# Altium schematic sheet FPGA_CONN_OUT.SchDoc
size 420 x 297 mm; SheetNumber: 31; SheetTotal: 34
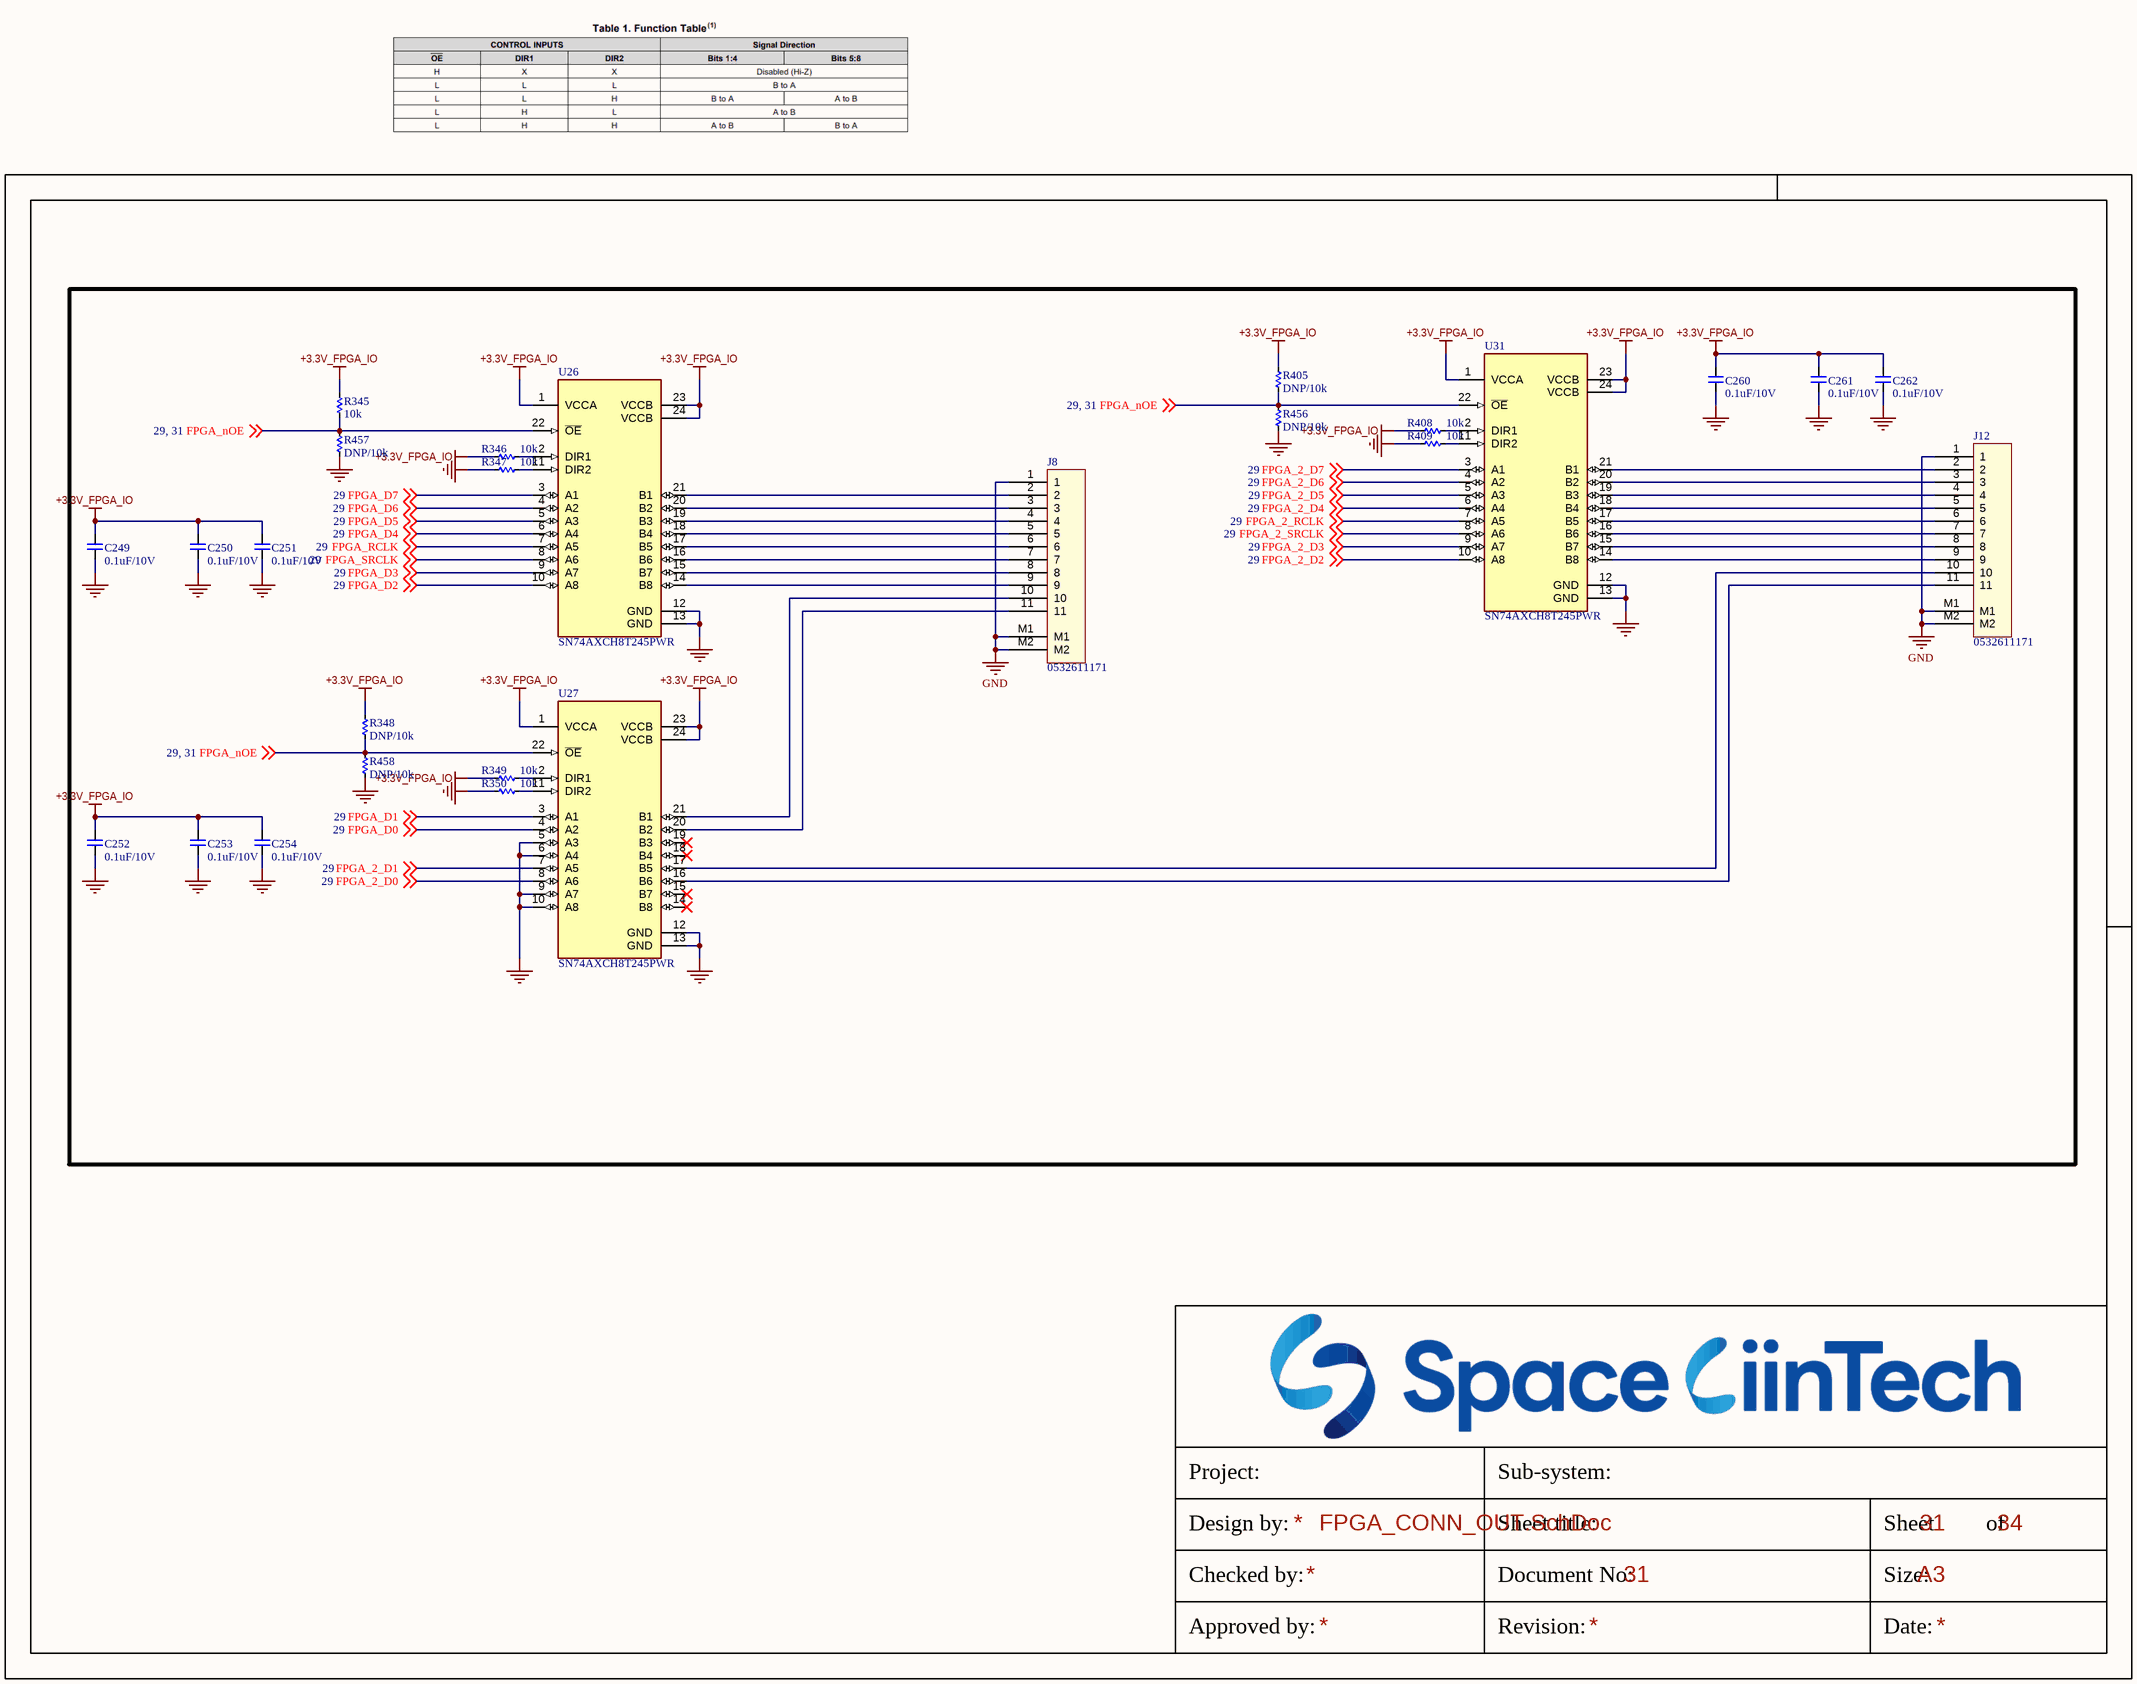
[diagram p0: FPGA_CONN_OUT.SchDoc]

## Parts
C249  0.1uF/10V  [CAP_C_1005X50_L]
C250  0.1uF/10V  [CAP_C_1005X50_L]
C251  0.1uF/10V  [CAP_C_1005X50_L]
C252  0.1uF/10V  [CAP_C_1005X50_L]
C253  0.1uF/10V  [CAP_C_1005X50_L]
C254  0.1uF/10V  [CAP_C_1005X50_L]
C260  0.1uF/10V  [CAP_C_1005X50_L]
C261  0.1uF/10V  [CAP_C_1005X50_L]
C262  0.1uF/10V  [CAP_C_1005X50_L]
J8  0532611171  [MOLEX_0532611171]
J12  0532611171  [MOLEX_0532611171]
R345  10k  [RES_C_1005x30_L]
R346  10k  [RES_C_1005x30_L]
R347  10k  [RES_C_1005x30_L]
R348  DNP/10k  [RES_C_1005x30_L]
R349  10k  [RES_C_1005x30_L]
R350  10k  [RES_C_1005x30_L]
R405  DNP/10k  [RES_C_1005x30_L]
R408  10k  [RES_C_1005x30_L]
R409  10k  [RES_C_1005x30_L]
R456  DNP/10k  [RES_C_1005x30_L]
R457  DNP/10k  [RES_C_1005x30_L]
R458  DNP/10k  [RES_C_1005x30_L]
U26  SN74AXCH8T245PWR  [SOP65P640X120-24N]
U27  SN74AXCH8T245PWR  [SOP65P640X120-24N]
U31  SN74AXCH8T245PWR  [SOP65P640X120-24N]

## Nets
+3.3V_FPGA_IO: C249.2 C250.2 C251.2 C252.2 C253.2 C254.2 C260.2 C261.2 C262.2 R345.1 R346.1 R348.1 R349.1 R405.1 R408.1 U26.1(VCCA) U26.23(VCCB) U26.24(VCCB) U27.1(VCCA) U27.23(VCCB) U27.24(VCCB) U31.1(VCCA) U31.23(VCCB) U31.24(VCCB)
GND: C249.1 C250.1 C251.1 C252.1 C253.1 C254.1 C260.1 C261.1 C262.1 J8.1 J8.M1 J8.M2 J12.1 J12.M1 J12.M2 R347.1 R350.1 R409.1 R456.2 R457.2 R458.2 U26.12(GND) U26.13(GND) U27.5(A3) U27.6(A4) U27.9(A7) U27.10(A8) U27.12(GND) U27.13(GND) U31.12(GND) U31.13(GND)
FPGA_2_D0: U27.8(A6) ; off-sheet FPGA_2_D0
FPGA_2_D1: U27.7(A5) ; off-sheet FPGA_2_D1
FPGA_2_D2: U31.10(A8) ; off-sheet FPGA_2_D2
FPGA_2_D3: U31.9(A7) ; off-sheet FPGA_2_D3
FPGA_2_D4: U31.6(A4) ; off-sheet FPGA_2_D4
FPGA_2_D5: U31.5(A3) ; off-sheet FPGA_2_D5
FPGA_2_D6: U31.4(A2) ; off-sheet FPGA_2_D6
FPGA_2_D7: U31.3(A1) ; off-sheet FPGA_2_D7
FPGA_2_RCLK: U31.7(A5) ; off-sheet FPGA_2_RCLK
FPGA_2_SRCLK: U31.8(A6) ; off-sheet FPGA_2_SRCLK
FPGA_D0: U27.4(A2) ; off-sheet FPGA_D0
FPGA_D1: U27.3(A1) ; off-sheet FPGA_D1
FPGA_D2: U26.10(A8) ; off-sheet FPGA_D2
FPGA_D3: U26.9(A7) ; off-sheet FPGA_D3
FPGA_D4: U26.6(A4) ; off-sheet FPGA_D4
FPGA_D5: U26.5(A3) ; off-sheet FPGA_D5
FPGA_D6: U26.4(A2) ; off-sheet FPGA_D6
FPGA_D7: U26.3(A1) ; off-sheet FPGA_D7
FPGA_nOE: R345.2 R348.2 R405.2 R456.1 R457.1 R458.1 U26.22(~{OE}) U27.22(~{OE}) U31.22(~{OE}) ; off-sheet FPGA_nOE
FPGA_RCLK: U26.7(A5) ; off-sheet FPGA_RCLK
FPGA_SRCLK: U26.8(A6) ; off-sheet FPGA_SRCLK
NetJ8_2: J8.2 U26.21(B1)
NetJ8_3: J8.3 U26.20(B2)
NetJ8_4: J8.4 U26.19(B3)
NetJ8_5: J8.5 U26.18(B4)
NetJ8_6: J8.6 U26.17(B5)
NetJ8_7: J8.7 U26.16(B6)
NetJ8_8: J8.8 U26.15(B7)
NetJ8_9: J8.9 U26.14(B8)
NetJ8_10: J8.10 U27.21(B1)
NetJ8_11: J8.11 U27.20(B2)
NetJ12_2: J12.2 U31.21(B1)
NetJ12_3: J12.3 U31.20(B2)
NetJ12_4: J12.4 U31.19(B3)
NetJ12_5: J12.5 U31.18(B4)
NetJ12_6: J12.6 U31.17(B5)
NetJ12_7: J12.7 U31.16(B6)
NetJ12_8: J12.8 U31.15(B7)
NetJ12_9: J12.9 U31.14(B8)
NetJ12_10: J12.10 U27.17(B5)
NetJ12_11: J12.11 U27.16(B6)
NetR346_2: R346.2 U26.2(DIR1)
NetR347_2: R347.2 U26.11(DIR2)
NetR349_2: R349.2 U27.2(DIR1)
NetR350_2: R350.2 U27.11(DIR2)
NetR408_2: R408.2 U31.2(DIR1)
NetR409_2: R409.2 U31.11(DIR2)

Not connected (* = marked no-connect by the designer): U27 14(B8)* 15(B7)* 18(B4)* 19(B3)*

## Notes on the sheet
- Project:
- Sub-system:
- Design by:
- Sheet title:
- Sheet
- of
- Checked by:
- Approved by:
- Revision:
- Document No:
- Size:
- Date:
- A3

## Library data of the parts
C249-C254 C260-C262 = _CAP_C_2: CAP
J8 J12 = Header 11x1_2M
R345-R350 R405 R408 R409 R456-R458 = _RES_B_2: RES
U26 U27 U31 = IC_voltage_level_SN74AXCH8T245PWR: 8-Bit Dual-Supply Bus Transceiver; MF: Texas Instruments; MP: SN74AXCH8T245PWR; Value: *; Check_prices: https://www.snapeda.com/parts/SN74AXCH8T245PWR/Texas+Instruments/view-part/?ref=eda; SnapEDA_Link: https://www.snapeda.com/parts/SN74AXCH8T245PWR/Texas+Instruments/view-part/?ref=snap; Price: None; Availability: In Stock; Purchase-URL: https://pricing.snapeda.com/search/part/SN74AXCH8T245PWR/?ref=eda; Package: TSSOP-24 Texas Instruments